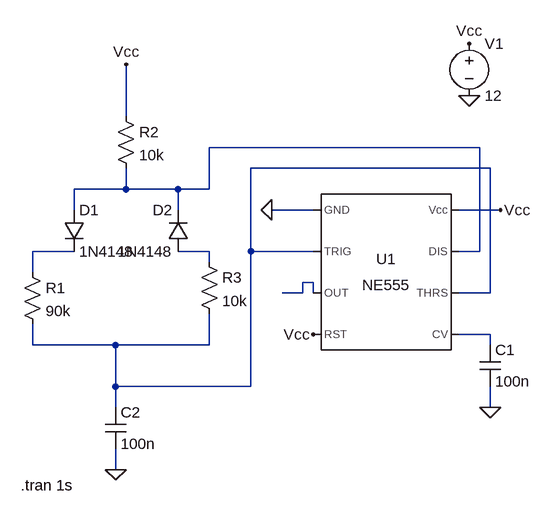
[diagram p0: schematic Draft1.asc]
Draft1.asc, the LTspice schematic file:
Version 4
SHEET 1 880 680
WIRE -144 -80 -144 -160
WIRE 400 -32 -16 -32
WIRE 416 0 48 0
WIRE -144 32 -144 0
WIRE -144 32 -224 32
WIRE -64 32 -144 32
WIRE -16 32 -16 -32
WIRE -16 32 -64 32
WIRE -224 64 -224 32
WIRE -64 64 -64 32
WIRE 144 64 80 64
WIRE 432 64 368 64
WIRE -224 128 -288 128
WIRE -16 128 -64 128
WIRE 48 128 48 0
WIRE 144 128 48 128
WIRE 400 128 400 -32
WIRE 400 128 368 128
WIRE -16 144 -16 128
WIRE -288 160 -288 128
WIRE 144 176 128 176
WIRE 128 192 128 176
WIRE 128 192 96 192
WIRE 144 192 144 176
WIRE 416 192 416 0
WIRE 416 192 368 192
WIRE 416 256 368 256
WIRE -288 272 -288 240
WIRE -160 272 -288 272
WIRE -16 272 -16 224
WIRE -16 272 -160 272
WIRE 416 272 416 256
WIRE -160 336 -160 272
WIRE 48 336 48 128
WIRE 48 336 -160 336
WIRE -160 368 -160 336
WIRE 416 368 416 336
WIRE -160 464 -160 432
FLAG 80 64 0
FLAG 416 368 0
FLAG -160 464 0
FLAG 384 -192 Vcc
FLAG -144 -160 Vcc
FLAG 432 64 Vcc
FLAG 144 256 Vcc
FLAG 384 -112 0
SYMBOL Misc\\NE555 256 160 R0
SYMATTR InstName U1
SYMBOL diode -240 64 R0
SYMATTR InstName D1
SYMATTR Value 1N4148
SYMBOL diode -48 128 R180
WINDOW 0 24 64 Left 2
WINDOW 3 24 0 Left 2
SYMATTR InstName D2
SYMATTR Value 1N4148
SYMBOL res -160 -96 R0
SYMATTR InstName R2
SYMATTR Value 10k
SYMBOL cap 400 272 R0
SYMATTR InstName C1
SYMATTR Value 100n
SYMBOL cap -176 368 R0
SYMATTR InstName C2
SYMATTR Value 100n
SYMBOL voltage 384 -208 R0
WINDOW 123 0 0 Left 0
WINDOW 39 0 0 Left 0
SYMATTR InstName V1
SYMATTR Value 12
SYMBOL res -304 144 R0
SYMATTR InstName R1
SYMATTR Value 90k
SYMBOL res -32 128 R0
SYMATTR InstName R3
SYMATTR Value 10k
TEXT -306 488 Left 2 !.tran 1s

The netlist it stands for:
* Draft1.asc
XU1 0 N002 N005 Vcc N006 N002 N001 Vcc NE555  ; pins GND TRIG OUT RST CV THRS DIS Vcc
D1 N001 N003 1N4148
D2 N004 N001 1N4148
R2 Vcc N001 10k
C1 N006 0 100n
C2 N002 0 100n
V1 Vcc 0 12
R1 N003 N002 90k
R3 N004 N002 10k
.model D D
.lib standard.dio
.tran 1s
.lib NE555.sub
.backanno
.end